# EAGLE design nes_snes_4_port (EAGLE 6.4)
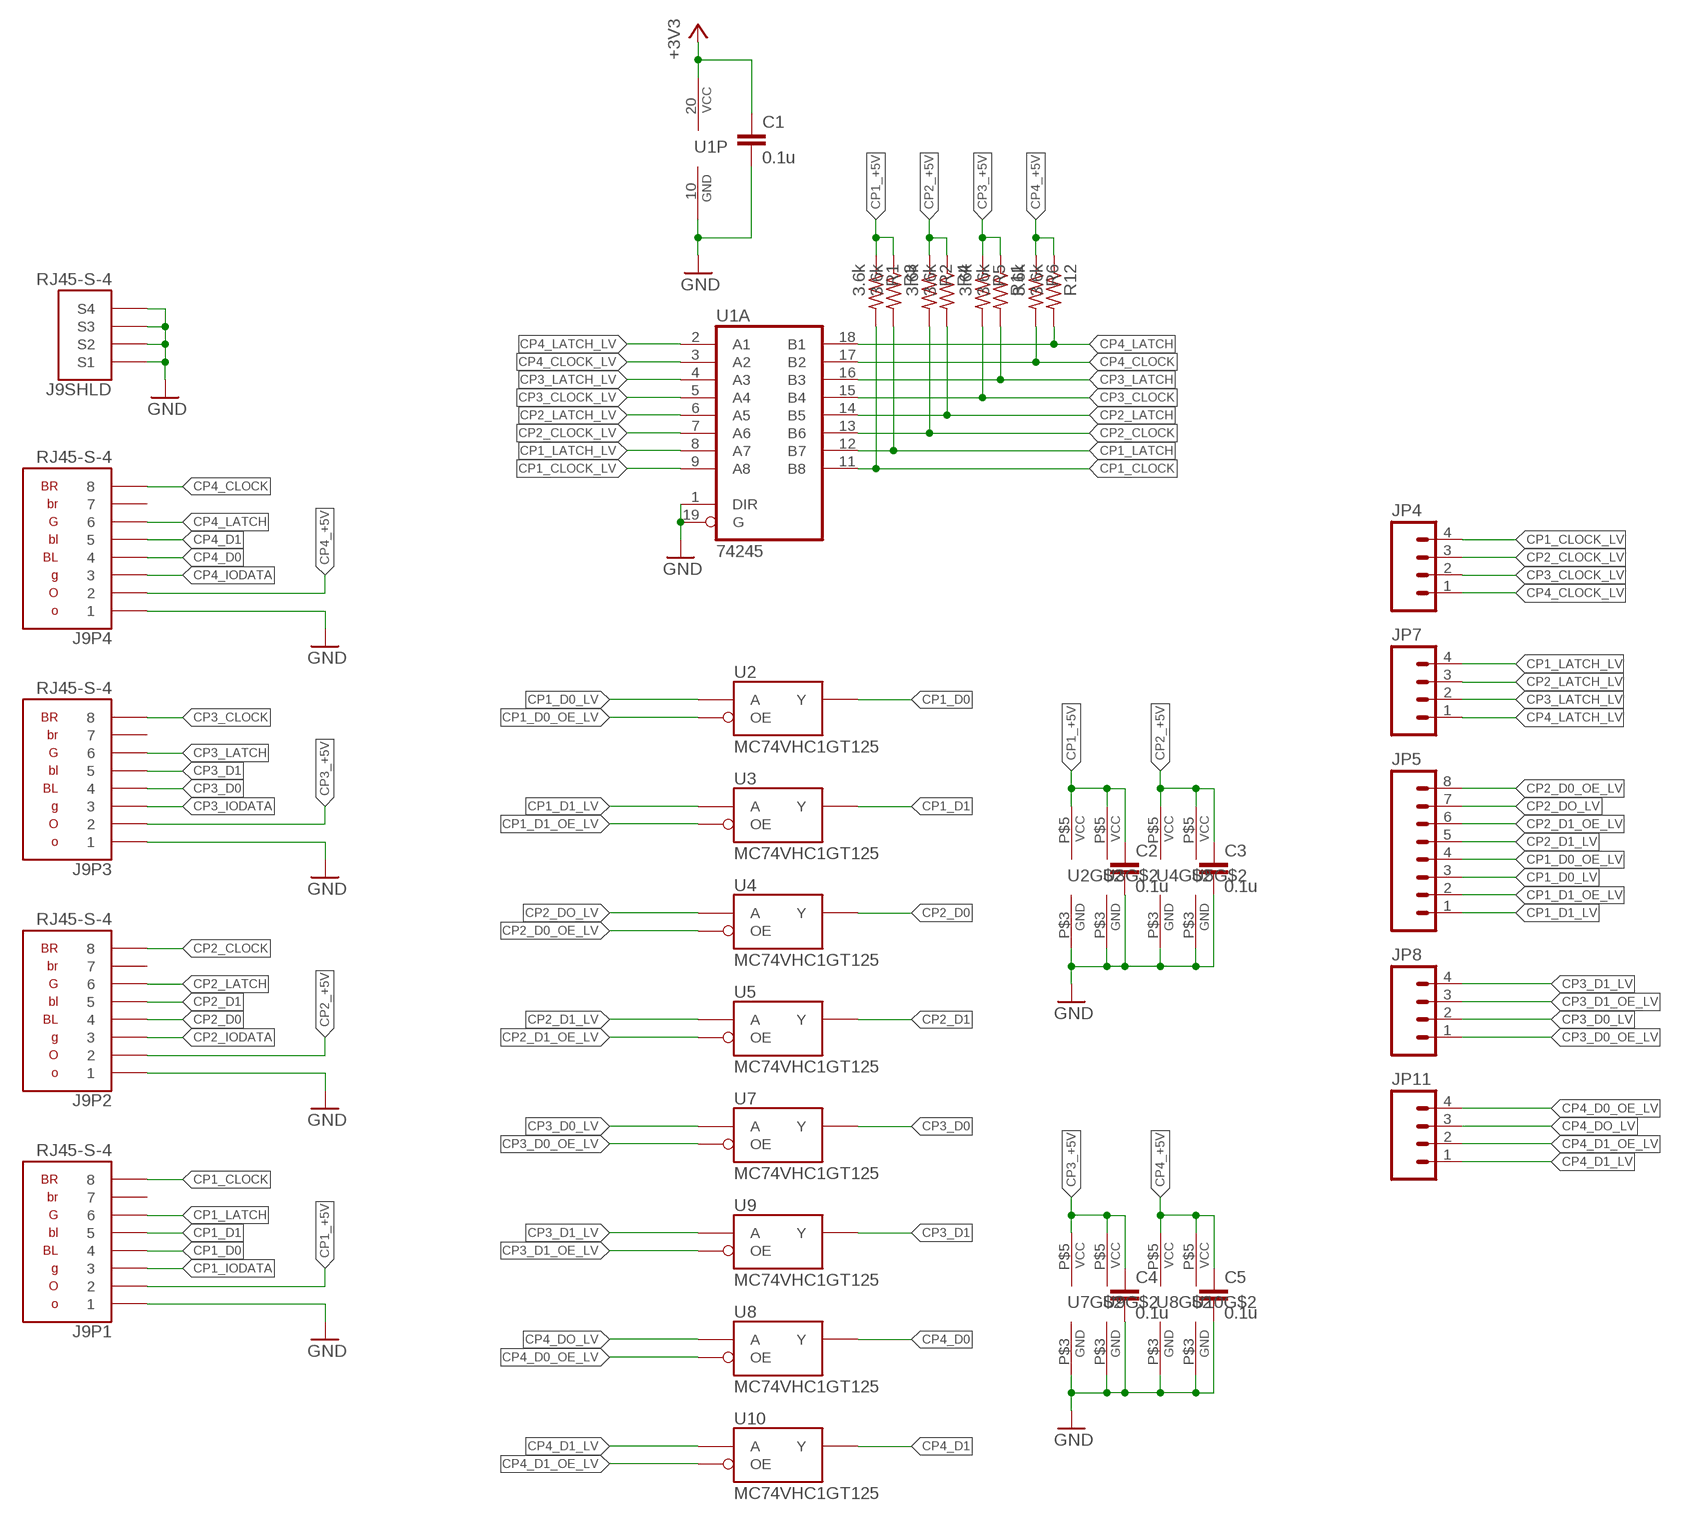
[diagram p0: schematic, sheet 1, part 1 of 2]
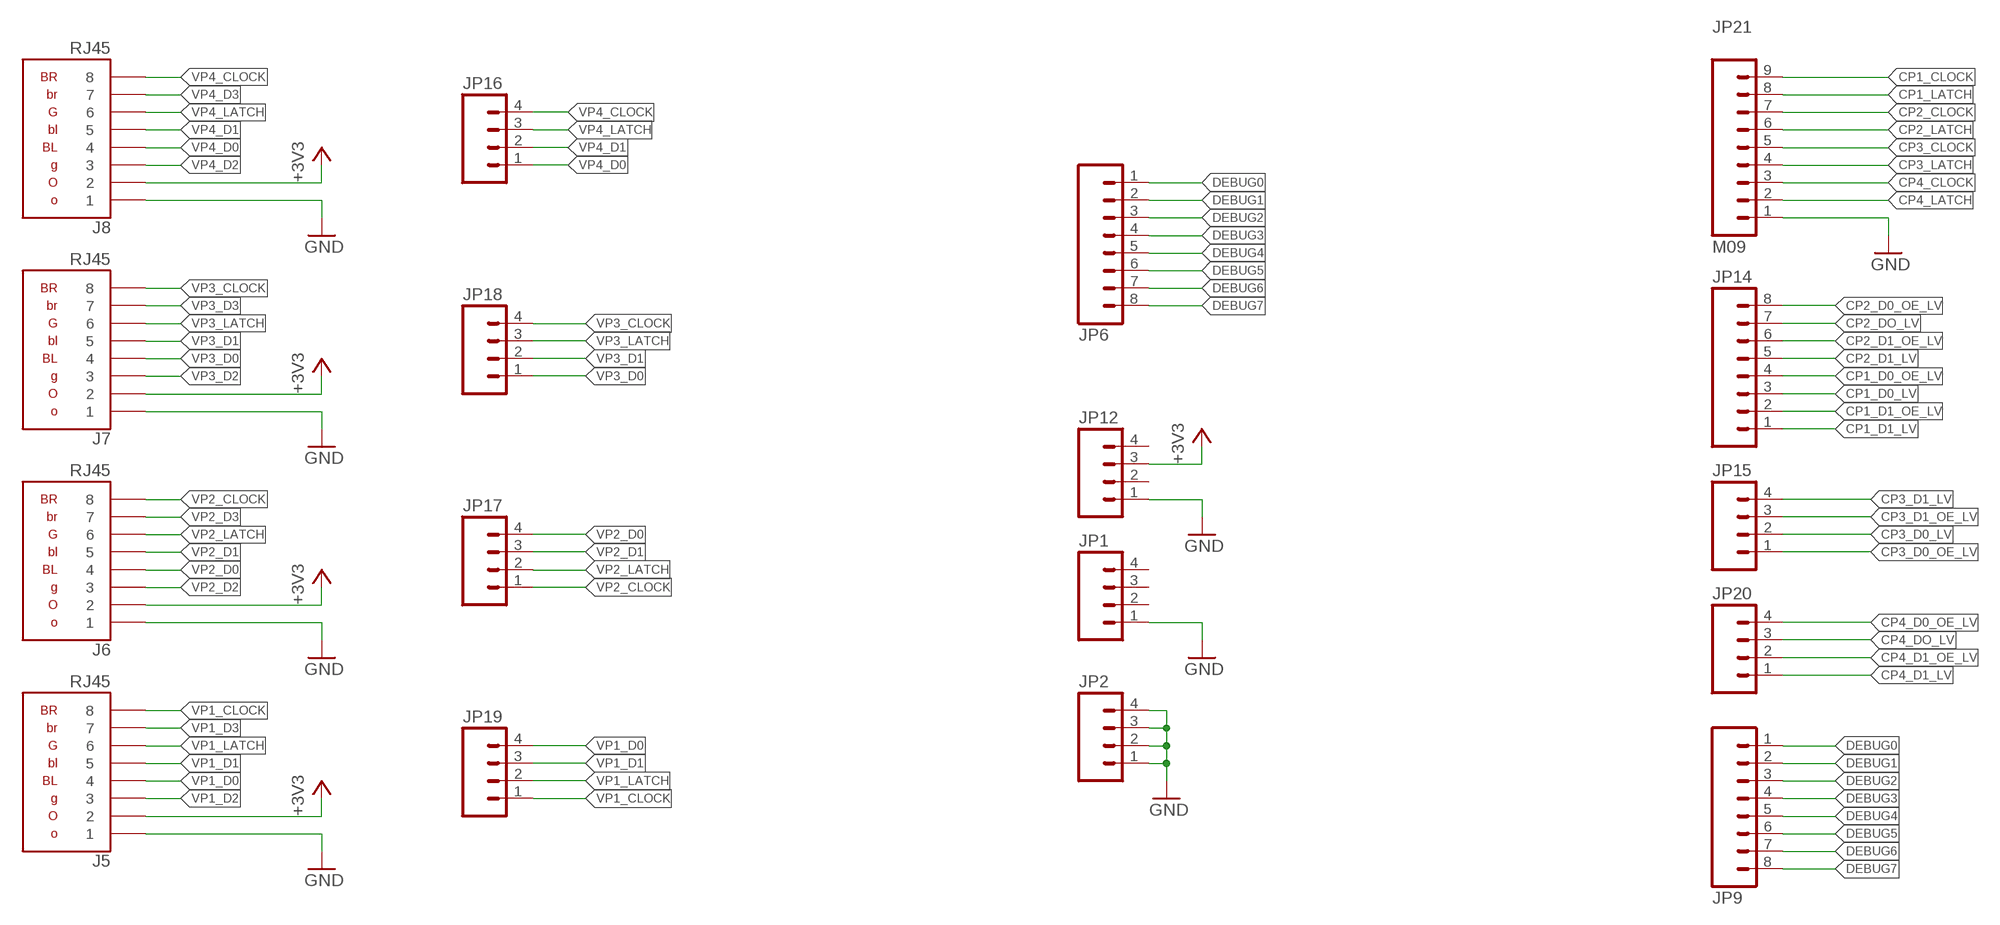
[diagram p1: schematic, sheet 1, part 2 of 2]

## Parts
C1  0.1u  C-EUC0603  [C0603]
C2  0.1u  C-EUC0603  [C0603]
C3  0.1u  C-EUC0603  [C0603]
C4  0.1u  C-EUC0603  [C0603]
C5  0.1u  C-EUC0603  [C0603]
J5  RJ45  [RJ45]
J6  RJ45  [RJ45]
J7  RJ45  [RJ45]
J8  RJ45  [RJ45]
J9  RJ45-S-4  [RJ45-S-4]
JP1  M04PTH  [1X04]
JP2  M04PTH  [1X04]
JP4  M04PTH  [1X04]
JP5  M081X08  [1X08]
JP6  M081X08  [1X08]
JP7  M04PTH  [1X04]
JP8  M04PTH  [1X04]
JP9  M081X08  [1X08]
JP11  M04PTH  [1X04]
JP12  M04PTH  [1X04]
JP14  M081X08  [1X08]
JP15  M04PTH  [1X04]
JP16  M04PTH  [1X04]
JP17  M04PTH  [1X04]
JP18  M04PTH  [1X04]
JP19  M04PTH  [1X04]
JP20  M04PTH  [1X04]
JP21  M09  [1X09]
R1  3.6k  R-US_0207/2V  [0207/2V]
R2  3.6k  R-US_0207/2V  [0207/2V]
R3  3.6k  R-US_0207/2V  [0207/2V]
R4  3.6k  R-US_0207/2V  [0207/2V]
R5  3.6k  R-US_0207/2V  [0207/2V]
R6  3.6k  R-US_0207/2V  [0207/2V]
R11  3.6k  R-US_0207/2V  [0207/2V]
R12  3.6k  R-US_0207/2V  [0207/2V]
U1  74245  [DIL20]
U2  MC74VHC1GT125  [TSOP-5]
U3  MC74VHC1GT125  [TSOP-5]
U4  MC74VHC1GT125  [TSOP-5]
U5  MC74VHC1GT125  [TSOP-5]
U7  MC74VHC1GT125  [TSOP-5]
U8  MC74VHC1GT125  [TSOP-5]
U9  MC74VHC1GT125  [TSOP-5]
U10  MC74VHC1GT125  [TSOP-5]

## Nets
+3V3: C1.1 J5.2 J6.2 J7.2 J8.2 JP12.3 U1.20(VCC)
CP1_+5V: C2.1 J9.1-2 R1.1 R3.1 U2.P$5(VCC) U3.P$5(VCC)
CP1_CLOCK: J9.1-8 JP21.9 R1.2 U1.11(B8)
CP1_CLOCK_LV: JP4.4 U1.9(A8)
CP1_D0: J9.1-4 U2.P$4(Y)
CP1_D0_LV: JP5.3 JP14.3 U2.P$2(A)
CP1_D0_OE_LV: JP5.4 JP14.4 U2.P$1(OE)
CP1_D1: J9.1-5 U3.P$4(Y)
CP1_D1_LV: JP5.1 JP14.1 U3.P$2(A)
CP1_D1_OE_LV: JP5.2 JP14.2 U3.P$1(OE)
CP1_IODATA: J9.1-3
CP1_LATCH: J9.1-6 JP21.8 R3.2 U1.12(B7)
CP1_LATCH_LV: JP7.4 U1.8(A7)
CP2_+5V: C3.1 J9.2-2 R2.1 R4.1 U4.P$5(VCC) U5.P$5(VCC)
CP2_CLOCK: J9.2-8 JP21.7 R2.2 U1.13(B6)
CP2_CLOCK_LV: JP4.3 U1.7(A6)
CP2_D0: J9.2-4 U4.P$4(Y)
CP2_D0_OE_LV: JP5.8 JP14.8 U4.P$1(OE)
CP2_D1: J9.2-5 U5.P$4(Y)
CP2_D1_LV: JP5.5 JP14.5 U5.P$2(A)
CP2_D1_OE_LV: JP5.6 JP14.6 U5.P$1(OE)
CP2_DO_LV: JP5.7 JP14.7 U4.P$2(A)
CP2_IODATA: J9.2-3
CP2_LATCH: J9.2-6 JP21.6 R4.2 U1.14(B5)
CP2_LATCH_LV: JP7.3 U1.6(A5)
CP3_+5V: C4.1 J9.3-2 R5.1 R11.1 U7.P$5(VCC) U9.P$5(VCC)
CP3_CLOCK: J9.3-8 JP21.5 R5.2 U1.15(B4)
CP3_CLOCK_LV: JP4.2 U1.5(A4)
CP3_D0: J9.3-4 U7.P$4(Y)
CP3_D0_LV: JP8.2 JP15.2 U7.P$2(A)
CP3_D0_OE_LV: JP8.1 JP15.1 U7.P$1(OE)
CP3_D1: J9.3-5 U9.P$4(Y)
CP3_D1_LV: JP8.4 JP15.4 U9.P$2(A)
CP3_D1_OE_LV: JP8.3 JP15.3 U9.P$1(OE)
CP3_IODATA: J9.3-3
CP3_LATCH: J9.3-6 JP21.4 R11.2 U1.16(B3)
CP3_LATCH_LV: JP7.2 U1.4(A3)
CP4_+5V: C5.1 J9.4-2 R6.1 R12.1 U8.P$5(VCC) U10.P$5(VCC)
CP4_CLOCK: J9.4-8 JP21.3 R6.2 U1.17(B2)
CP4_CLOCK_LV: JP4.1 U1.3(A2)
CP4_D0: J9.4-4 U8.P$4(Y)
CP4_D0_OE_LV: JP11.4 JP20.4 U8.P$1(OE)
CP4_D1: J9.4-5 U10.P$4(Y)
CP4_D1_LV: JP11.1 JP20.1 U10.P$2(A)
CP4_D1_OE_LV: JP11.2 JP20.2 U10.P$1(OE)
CP4_DO_LV: JP11.3 JP20.3 U8.P$2(A)
CP4_IODATA: J9.4-3
CP4_LATCH: J9.4-6 JP21.2 R12.2 U1.18(B1)
CP4_LATCH_LV: JP7.1 U1.2(A1)
DEBUG0: JP6.1 JP9.1
DEBUG1: JP6.2 JP9.2
DEBUG2: JP6.3 JP9.3
DEBUG3: JP6.4 JP9.4
DEBUG4: JP6.5 JP9.5
DEBUG5: JP6.6 JP9.6
DEBUG6: JP6.7 JP9.7
DEBUG7: JP6.8 JP9.8
GND: C1.2 C2.2 C3.2 C4.2 C5.2 J5.1 J6.1 J7.1 J8.1 J9.1-1 J9.2-1 J9.3-1 J9.4-1 J9.S1(SHLD:S1) J9.S2(SHLD:S2) J9.S3(SHLD:S3) J9.S4(SHLD:S4) JP1.1 JP2.1 JP2.2 JP2.3 JP2.4 JP12.1 JP21.1 U1.1(DIR) U1.10(GND) U1.19(G) U2.P$3(GND) U3.P$3(GND) U4.P$3(GND) U5.P$3(GND) U7.P$3(GND) U8.P$3(GND) U9.P$3(GND) U10.P$3(GND)
VP1_CLOCK: J5.8 JP19.1
VP1_D0: J5.4 JP19.4
VP1_D1: J5.5 JP19.3
VP1_D2: J5.3
VP1_D3: J5.7
VP1_LATCH: J5.6 JP19.2
VP2_CLOCK: J6.8 JP17.1
VP2_D0: J6.4 JP17.4
VP2_D1: J6.5 JP17.3
VP2_D2: J6.3
VP2_D3: J6.7
VP2_LATCH: J6.6 JP17.2
VP3_CLOCK: J7.8 JP18.4
VP3_D0: J7.4 JP18.1
VP3_D1: J7.5 JP18.2
VP3_D2: J7.3
VP3_D3: J7.7
VP3_LATCH: J7.6 JP18.3
VP4_CLOCK: J8.8 JP16.4
VP4_D0: J8.4 JP16.1
VP4_D1: J8.5 JP16.2
VP4_D2: J8.3
VP4_D3: J8.7
VP4_LATCH: J8.6 JP16.3
Unconnected: J9.1-7 J9.2-7 J9.3-7 J9.4-7 JP1.2 JP1.3 JP1.4 JP12.2 JP12.4

## Library data of the parts
C1-C5 = rcl:C-EU: CAPACITOR, European symbol
J5-J8 = TASLink:RJ45
J9 = TASLink:RJ45-S-4
JP1 JP2 JP4 JP7 JP8 JP11 JP12 JP15-JP20 = SparkFun-Connectors:M04: Header 4 Standard 4-pin 0.1" header. Use with straight break away headers (SKU : PRT-00116), right angle break away headers (PRT-00553), swiss pins (PRT-00743), machine pins (PRT-00117), and female headers (PRT-00115). Molex polarized connector foot print use with SKU : PRT-08231 with associated crimp pins and housings. 1MM SMD Version SKU: PRT-10208
JP5 JP6 JP9 JP14 = SparkFun-Connectors:M08: Header 8 Standard 8-pin 0.1" header. Use with straight break away headers (SKU : PRT-00116), right angle break away headers (PRT-00553), swiss pins (PRT-00743), machine pins (PRT-00117), and female headers (PRT-00115).
JP21 = SparkFun-Connectors:M09: Header 9 Standard 9-pin 0.1" header. Use with straight break away headers (SKU : PRT-00116), right angle break away headers (PRT-00553), swiss pins (PRT-00743), machine pins (PRT-00117), and female headers (PRT-00115).
R1-R6 R11 R12 = rcl:R-US_: RESISTOR, American symbol
U1 = TASLink:74245
U2-U5 U7-U10 = TASLink:MC74VHC1GT125

## Board
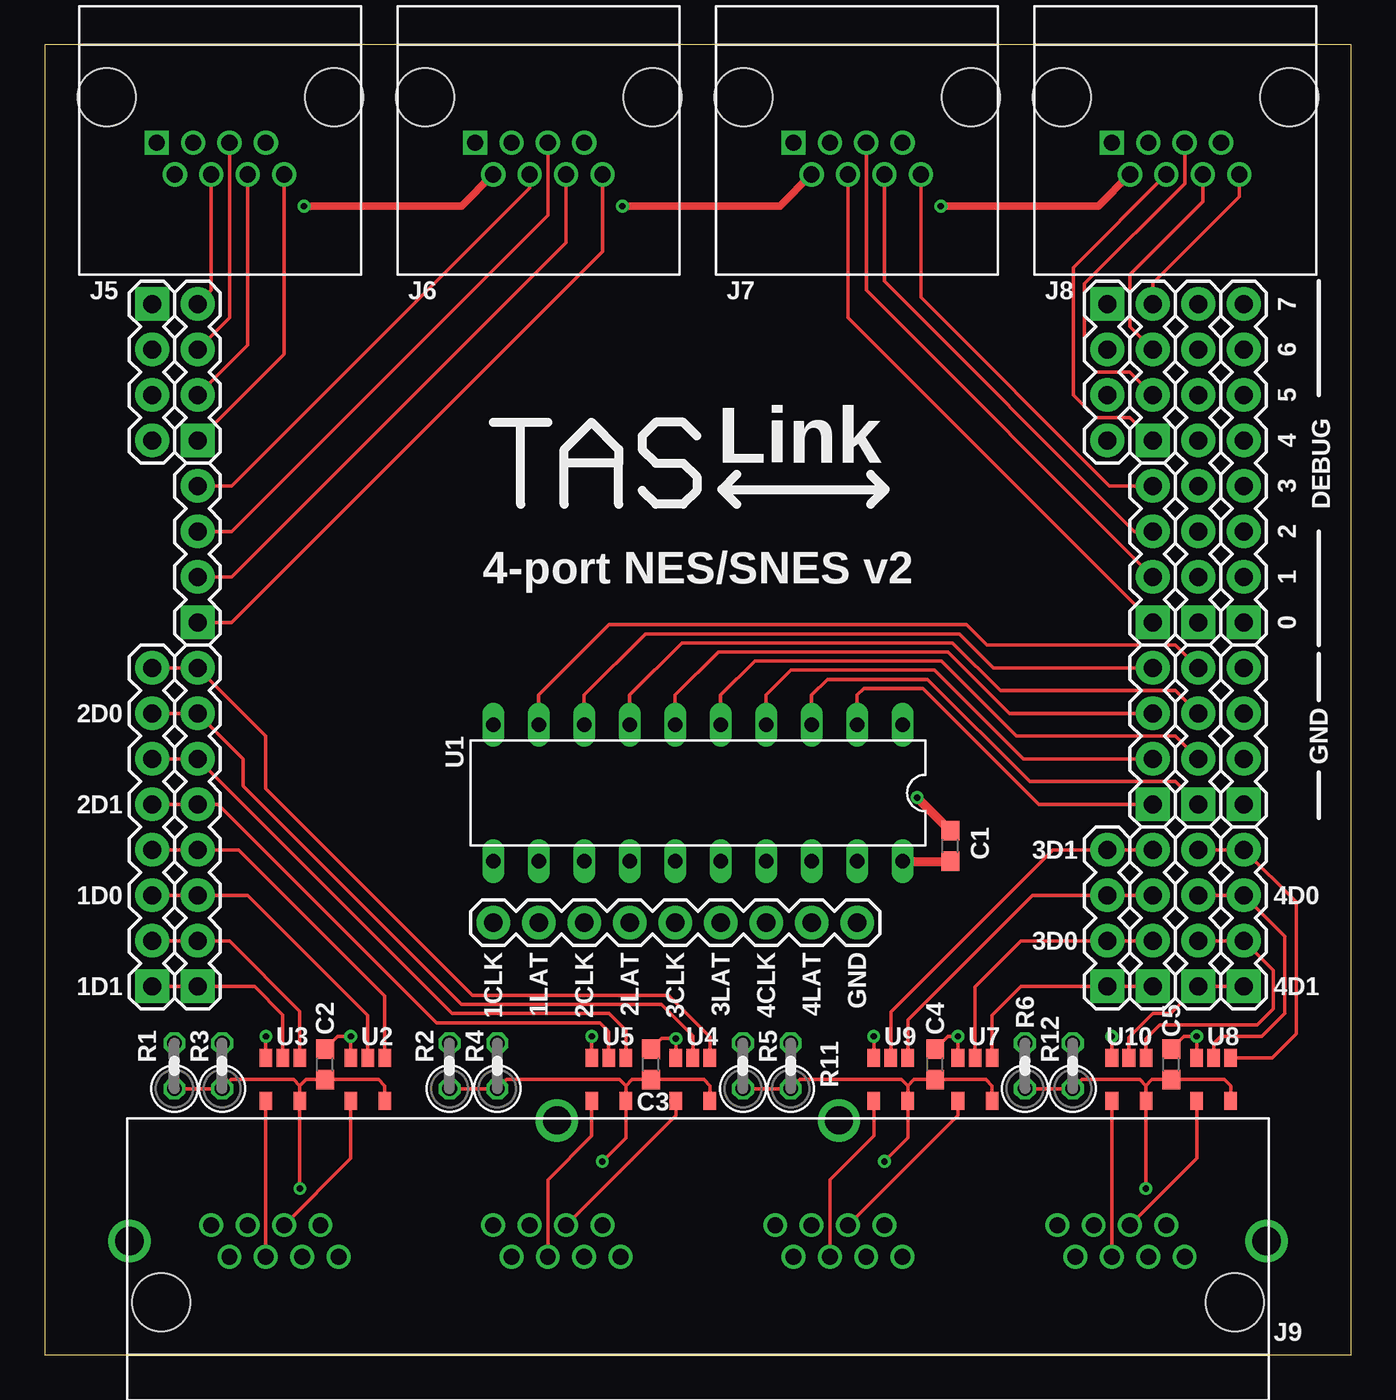
[diagram p2: board, top side]
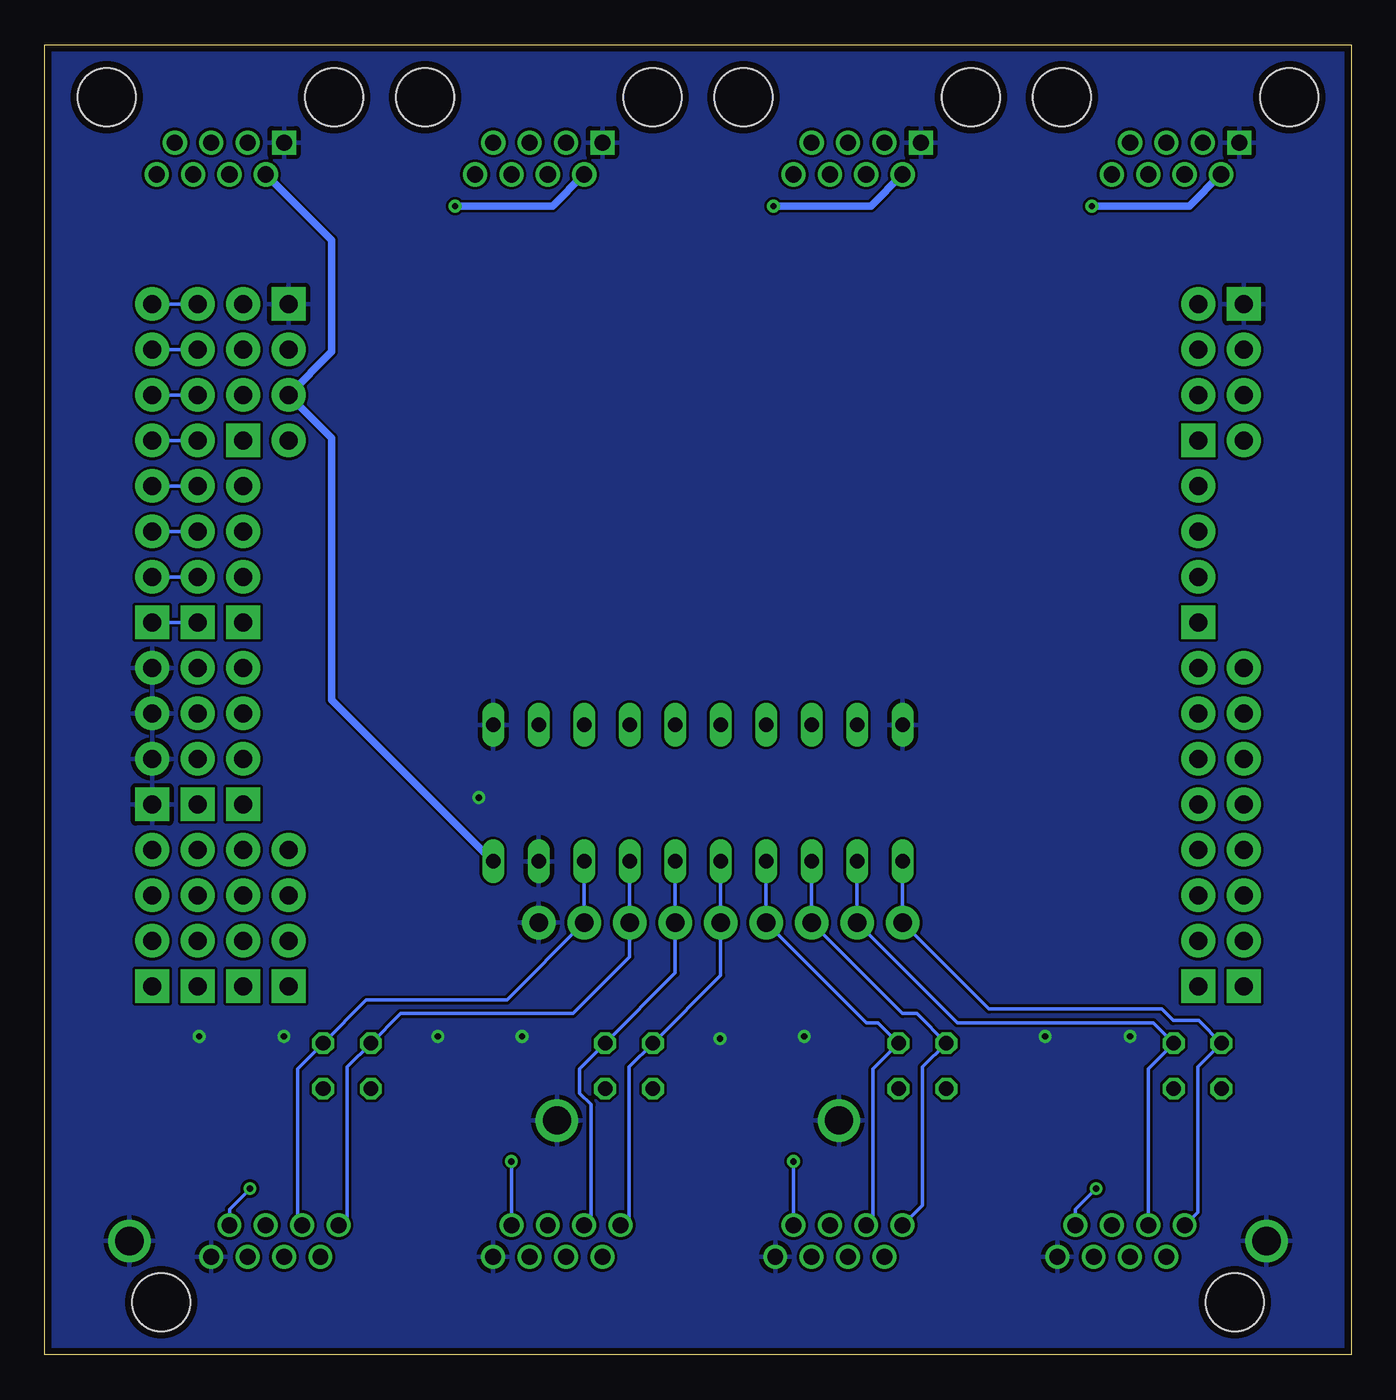
[diagram p3: board, bottom side, seen from below]

Size 72.95 x 73.15 mm. Coordinates in mm from the lower left corner, seen from the top.
Outline: 0,0 72.95,0 72.95,73.15 0,73.15 0,0
Copper layers (1*16): Top 0.0356mm / dielectric 1.5011mm / Bottom 0.0356mm
Design rules "LaenPCBOrder *": minimum track width 6mil, minimum drill 13mil, track to track 6mil, track to pad 6mil, pad to pad 6mil, via to via 6mil, smd to smd 6mil, copper to edge 15mil, drill to drill 6mil, minimum pad ring 7mil, minimum via ring 7mil, stop-mask expansion 3mil, vias tented up to drill 15mil, thermal gap 10mil

### Footprints (pad centres in the part's own frame; a part is rotated, then mirrored left to right if it is on the bottom)
C0603 = smd 1.1 x 1: 1 -0.85,0; 2 0.85,0
RJ45 = drill 0.9 square: 1 3.556,-0.889 | drill 0.9: 2 2.54,0.889; 3 1.524,-0.889; 4 0.508,0.889; 5 -0.508,-0.889; 6 -1.524,0.889; 7 -2.54,-0.889; 8 -3.556,0.889 | hole 3.251: -6.35,-3.429; 6.35,-3.429
RJ45-S-4 = drill 0.889: 1-1 -20.066,2.54; 1-2 -21.082,4.318; 1-3 -22.098,2.54; 1-4 -23.114,4.318; 1-5 -24.13,2.54; 1-6 -25.146,4.318; 1-7 -26.162,2.54; 1-8 -27.178,4.318; 2-1 -4.318,2.54; 2-2 -5.334,4.318; 2-3 -6.35,2.54; 2-4 -7.366,4.318; 2-5 -8.382,2.54; 2-6 -9.398,4.318; 2-7 -10.414,2.54; 2-8 -11.43,4.318; 3-1 11.43,2.54; 3-2 10.414,4.318; 3-3 9.398,2.54; 3-4 8.382,4.318; 3-5 7.366,2.54; 3-6 6.35,4.318; 3-7 5.334,2.54; 3-8 4.318,4.318; 4-1 27.178,2.54; 4-2 26.162,4.318; 4-3 25.146,2.54; 4-4 24.13,4.318; 4-5 23.114,2.54; 4-6 22.098,4.318; 4-7 21.082,2.54; 4-8 20.066,4.318 | drill 1.575: S1 31.75,3.429; S2 -31.75,3.429; S3 -7.874,10.16; S4 7.874,10.16 | hole 3.251: -29.972,0; 29.972,0
1X04 = drill 1.016 pad 1.88 square: 1 0,0 | drill 1.016 pad 1.88: 2 2.54,0; 3 5.08,0; 4 7.62,0
1X08 = drill 1.016 pad 1.88 square: 1 0,0 | drill 1.016 pad 1.88: 2 2.54,0; 3 5.08,0; 4 7.62,0; 5 10.16,0; 6 12.7,0; 7 15.24,0; 8 17.78,0
1X09 = drill 1.016 pad 1.88: 1 0,0; 2 2.54,0; 3 5.08,0; 4 7.62,0; 5 10.16,0; 6 12.7,0; 7 15.24,0; 8 17.78,0; 9 20.32,0
0207/2V = drill 0.813 octagon: 1 -1.27,0; 2 1.27,0
DIL20 = drill 0.813 long: 1 -11.43,-3.81; 2 -8.89,-3.81; 3 -6.35,-3.81; 4 -3.81,-3.81; 5 -1.27,-3.81; 6 1.27,-3.81; 7 3.81,-3.81; 8 6.35,-3.81; 9 8.89,-3.81; 10 11.43,-3.81; 11 11.43,3.81; 12 8.89,3.81; 13 6.35,3.81; 14 3.81,3.81; 15 1.27,3.81; 16 -1.27,3.81; 17 -3.81,3.81; 18 -6.35,3.81; 19 -8.89,3.81; 20 -11.43,3.81
TSOP-5 = smd 0.7 x 1: P$1 0.95,1.2; P$2 0,1.2; P$3 -0.95,1.2; P$4 -0.95,-1.2; P$5 0.95,-1.2

### Placement (x,y rotation side)
C1  50.57,28.41 90 top
C2  15.65,16.22 90 top
C3  33.85,16.22 90 top
C4  49.72,16.22 90 top
C5  62.91,16.22 90 top
J5  9.8,66.8 180 top
J6  27.58,66.8 180 top
J7  45.36,66.8 180 top
J8  63.14,66.8 180 top
J9  36.47,2.92 0 top
JP1  5.99,58.67 270 top
JP2  66.95,30.73 90 top
JP4  64.41,30.73 90 top
JP5  8.53,20.57 90 top
JP6  64.41,40.89 90 top
JP7  61.87,30.73 90 top
JP8  61.87,20.57 90 top
JP9  66.95,40.89 90 top
JP11  64.41,20.57 90 top
JP12  59.33,58.67 270 top
JP14  5.99,20.57 90 top
JP15  59.33,20.57 90 top
JP16  61.87,51.05 90 top
JP17  8.53,40.89 90 top
JP18  61.87,40.89 90 top
JP19  8.53,51.05 90 top
JP20  66.95,20.57 90 top
JP21  45.36,24.13 180 top
R1  7.24,16.13 90 top
R2  22.61,16.13 90 top
R3  9.91,16.13 90 top
R4  25.27,16.13 90 top
R5  38.99,16.13 90 top
R6  54.74,16.13 90 top
R11  41.66,16.13 90 top
R12  57.4,16.13 90 top
U1  36.47,31.37 180 top
U2  18.03,15.37 0 top
U3  13.29,15.37 0 top
U4  36.2,15.37 0 top
U5  31.5,15.37 0 top
U7  51.94,15.37 0 top
U8  65.28,15.37 0 top
U9  47.24,15.37 0 top
U10  60.54,15.37 0 top

### Tracks (layer width: path | path; a pad name or v marks a point on that pad's centre or on a via)
+3V3  (via drill 0.36)
  Top 0.406: v14.48,64.14 23.27,64.14 J6.2 | v32.26,64.14 41.05,64.14 J7.2 | v50.04,64.14 58.83,64.14 J8.2
  Top 0.508: U1.20 C1.1
  Bottom 0.406: v14.48,64.14 9.04,64.14 J5.2 | v32.26,64.14 26.82,64.14 J6.2 | v50.04,64.14 44.6,64.14 J7.2 | J8.2 56.92,62.23 56.92,56.01 JP12.3 56.92,51.18 56.92,36.58 U1.20
CP1_+5V  (via drill 0.36)
  Top 0.203: 14.24,15.02 U3.P$5 v14.24,9.28 | 14.24,15.02 14.59,15.37 C2.1 18.64,15.37 18.98,15.02 U2.P$5 | 14.24,15.02 13.9,15.37 10.41,15.37 R3.1 R1.1
  Bottom 0.203: J9.1-2 15.39,8.13 v14.24,9.28
CP1_CLOCK
  Bottom 0.203: U1.11 JP21.9 20.22,19.3 10.57,19.3 9.93,18.67 8.51,18.67 R1.2 8.57,16.07 8.57,7.96 J9.1-8
CP1_CLOCK_LV
  Top 0.203: JP4.4 63.14,39.62 52.6,39.62 51.46,40.77 31.52,40.77 27.58,36.83 U1.9
CP1_D0
  Top 0.203: U2.P$4 17.08,10.96 J9.1-4
CP1_D0_LV
  Top 0.203: U2.P$2 18.03,18.95 11.33,25.65 JP5.3 JP14.3
CP1_D0_OE_LV
  Top 0.203: U2.P$1 18.98,20.03 10.82,28.19 JP5.4 JP14.4
CP1_D1
  Top 0.203: J9.1-5 U3.P$4
CP1_D1_LV
  Top 0.203: U3.P$2 13.29,18.99 11.71,20.57 JP5.1 JP14.1
CP1_D1_OE_LV
  Top 0.203: U3.P$1 14.24,19.18 10.31,23.11 JP5.2 JP14.2
CP1_LATCH
  Bottom 0.203: J9.1-6 11.33,15.98 R3.2 11.05,18.54 22,18.54 JP21.8 U1.12
CP1_LATCH_LV
  Top 0.203: JP7.4 52.98,38.35 51.08,40.26 33.55,40.26 30.12,36.83 U1.8
CP2_+5V  (via drill 0.36)
  Top 0.203: v31.14,10.79 32.45,12.1 U5.P$5 32.45,15.02 | U4.P$5 37.15,15.02 36.8,15.37 C3.1 32.79,15.37 32.45,15.02 | R2.1 R4.1 25.78,15.37 32.1,15.37 32.45,15.02
  Bottom 0.203: J9.2-2 v31.14,10.79
CP2_CLOCK
  Bottom 0.203: U1.13 JP21.7 25.04,19.05 24.26,19.05 R2.2 23.94,16.07 23.94,8.34 J9.2-8
CP2_CLOCK_LV
  Top 0.203: JP4.3 63.14,37.08 53.37,37.08 50.7,39.75 35.59,39.75 32.66,36.83 U1.7
CP2_D0
  Top 0.203: J9.2-4 35.25,13.38 U4.P$4
CP2_D0_OE_LV
  Top 0.203: U4.P$1 37.15,17.74 34.82,20.07 23.9,20.07 12.34,31.62 12.34,34.54 JP5.8 JP14.8
CP2_D1
  Top 0.203: U5.P$4 30.55,12.23 28.09,9.78 J9.2-5
CP2_D1_LV
  Top 0.203: U5.P$2 31.5,18.06 31.01,18.54 21.87,18.54 9.68,30.73 JP5.5 JP14.5
CP2_D1_OE_LV
  Top 0.203: U5.P$1 32.45,18.12 31.52,19.05 22.76,19.05 JP5.6 JP14.6
CP2_DO_LV
  Top 0.203: U4.P$2 36.2,17.8 34.44,19.56 23.27,19.56 11.07,31.75 11.07,33.27 JP5.7 JP14.7
CP2_LATCH
  Bottom 0.203: U1.14 JP21.6 27.08,18.54 26.42,18.54 R4.2 26.7,15.98 26.7,7.62 J9.2-6
CP2_LATCH_LV
  Top 0.203: JP7.3 53.87,35.81 50.44,39.24 37.62,39.24 35.2,36.83 U1.6
CP3_+5V  (via drill 0.36)
  Top 0.203: v46.89,10.79 48.19,12.1 U9.P$5 48.19,15.02 | 48.19,15.02 48.54,15.37 C4.1 52.55,15.37 52.89,15.02 U7.P$5 | R5.1 R11.1 42.16,15.37 47.85,15.37 48.19,15.02
  Bottom 0.203: J9.3-2 v46.89,10.79
CP3_CLOCK
  Bottom 0.203: U1.15 JP21.5 35.2,21.18 R5.2 40.32,16.07 40.32,7.71 J9.3-8
CP3_CLOCK_LV
  Top 0.203: JP4.2 63.14,34.54 54.25,34.54 50.06,38.73 39.65,38.73 37.74,36.83 U1.5
CP3_D0
  Top 0.203: J9.3-4 50.99,13.38 U7.P$4
CP3_D0_LV
  Top 0.203: U7.P$2 51.94,20.55 54.51,23.11 JP15.2 JP8.2
CP3_D0_OE_LV
  Top 0.203: U7.P$1 52.89,18.96 54.51,20.57 JP15.1 JP8.1
CP3_D1
  Top 0.203: U9.P$4 46.29,12.23 43.84,9.78 J9.3-5
CP3_D1_LV
  Top 0.203: U9.P$2 47.24,19.15 56.29,28.19 JP15.4 JP8.4
CP3_D1_OE_LV
  Top 0.203: U9.P$1 48.19,18.7 55.14,25.65 JP15.3 JP8.3
CP3_LATCH
  Bottom 0.203: U1.16 JP21.4 37.74,21.31 R11.2 43.08,15.98 43.08,14.61 42.44,13.97 42.44,7.62 J9.3-6
CP3_LATCH_LV
  Top 0.203: U1.4 40.28,36.83 41.68,38.23 49.68,38.23 54.64,33.27 JP7.2
CP4_+5V  (via drill 0.36)
  Top 0.203: v61.49,9.28 U10.P$5 61.49,15.02 | U8.P$5 66.23,15.02 65.88,15.37 C5.1 61.83,15.37 61.49,15.02 | R6.1 R12.1 57.91,15.37 61.14,15.37 61.49,15.02
  Bottom 0.203: J9.4-2 62.64,8.13 v61.49,9.28
CP4_CLOCK
  Bottom 0.203: U1.17 JP21.3 40.28,22.23 43.46,19.05 53.09,19.05 R6.2 56.07,16.07 56.07,7.71 J9.4-8
CP4_CLOCK_LV
  Top 0.203: JP4.1 63.14,32 55.02,32 49.3,37.72 43.71,37.72 42.82,36.83 U1.3
CP4_D0
  Top 0.203: J9.4-4 64.33,10.96 U8.P$4
CP4_D0_OE_LV
  Top 0.203: U8.P$1 68.54,16.57 69.88,17.91 69.88,25.27 JP20.4 JP11.4
CP4_D1
  Top 0.203: U10.P$4 J9.4-5
CP4_D1_LV
  Top 0.203: U10.P$2 60.54,17.71 61.87,19.05 62.89,19.05 JP11.1 JP20.1
CP4_D1_OE_LV
  Top 0.203: U10.P$1 61.49,17.65 62.26,18.41 67.72,18.41 68.61,19.3 68.61,21.46 JP20.2 JP11.2
CP4_DO_LV
  Top 0.203: U8.P$2 65.28,17.37 65.68,17.78 67.97,17.78 69.24,19.05 69.24,23.37 JP20.3 JP11.3
CP4_LATCH
  Bottom 0.203: U1.18 JP21.2 47.14,19.81 54.99,19.81 R12.2 58.83,15.98 58.83,7.49 J9.4-6
CP4_LATCH_LV
  Top 0.203: U1.2 45.36,36.83 45.75,37.21 49.05,37.21 55.52,30.73 JP7.1
DEBUG0
  Bottom 0.203: JP6.1 JP9.1
DEBUG1
  Bottom 0.203: JP6.2 JP9.2
DEBUG2
  Bottom 0.203: JP6.3 JP9.3
DEBUG3
  Bottom 0.203: JP6.4 JP9.4
DEBUG4
  Bottom 0.203: JP6.5 JP9.5
DEBUG5
  Bottom 0.203: JP6.6 JP9.6
DEBUG6
  Bottom 0.203: JP6.7 JP9.7
DEBUG7
  Bottom 0.203: JP6.8 JP9.8
GND  (via drill 0.36)
  Top 0.203: U2.P$3 v17.08,17.78 16.36,17.78 C2.2 | U3.P$3 v12.34,17.78 | U5.P$3 v30.55,17.78 | U4.P$3 v35.25,17.65 34.43,17.65 C3.2 | U7.P$3 v50.99,17.78 50.43,17.78 C4.2 | U9.P$3 v46.29,17.78 | U10.P$3 v59.59,17.78 | U8.P$3 v64.33,17.78 63.62,17.78 C5.2
  Top 0.508: C1.2 v48.72,31.11
  pour Bottom: 0,73.15 72.95,73.15 72.95,0 0,0
VP1_CLOCK
  Top 0.203: JP19.1 13.36,55.88 J5.8
VP1_D0
  Top 0.203: JP19.4 9.3,59.44 J5.4
VP1_D1
  Top 0.203: JP19.3 10.31,57.91 J5.5
VP1_LATCH
  Top 0.203: JP19.2 11.33,56.39 J5.6
VP2_CLOCK
  Top 0.203: JP17.1 10.44,40.89 31.14,61.59 J6.8
VP2_D0
  Top 0.203: JP17.4 10.44,48.51 27.08,65.15 J6.4
VP2_D1
  Top 0.203: JP17.3 10.44,45.97 28.09,63.63 J6.5
VP2_LATCH
  Top 0.203: JP17.2 10.44,43.43 29.11,62.1 J6.6
VP3_CLOCK
  Top 0.203: J7.8 48.92,59.05 59.46,48.51 JP18.4
VP3_D0
  Top 0.203: JP18.1 44.86,57.91 J7.4
VP3_D1
  Top 0.203: JP18.2 45.87,59.44 J7.5
VP3_LATCH
  Top 0.203: J7.6 46.89,59.94 60.86,45.97 JP18.3
VP4_CLOCK
  Top 0.203: JP16.4 61.87,59.84 66.7,64.67 J8.8
VP4_D0
  Top 0.203: JP16.1 60.6,52.32 58.7,52.32 57.43,53.59 57.43,60.71 J8.4
VP4_D1
  Top 0.203: JP16.2 60.6,54.86 58.7,54.86 58.06,55.5 58.06,59.82 63.65,65.41 J8.5
VP4_LATCH
  Top 0.203: JP16.3 60.6,57.4 60.6,60.33 64.67,64.39 J8.6

### Text on the board
tPlace: 7 | 6 | 5 | 4 | Link | DEBUG | 3 | 2 | 4-port NES/SNES v2 | 1 | 0 | 2D0 | GND | 2D1 | 3D1 | 1D0 | 4D0 | 3D0 | 1CLK | 1LAT | 2CLK | 2LAT | 3CLK | 3LAT | 4CLK | 4LAT | GND | 1D1 | 4D1